# Altium project MyFly.PrjPCB
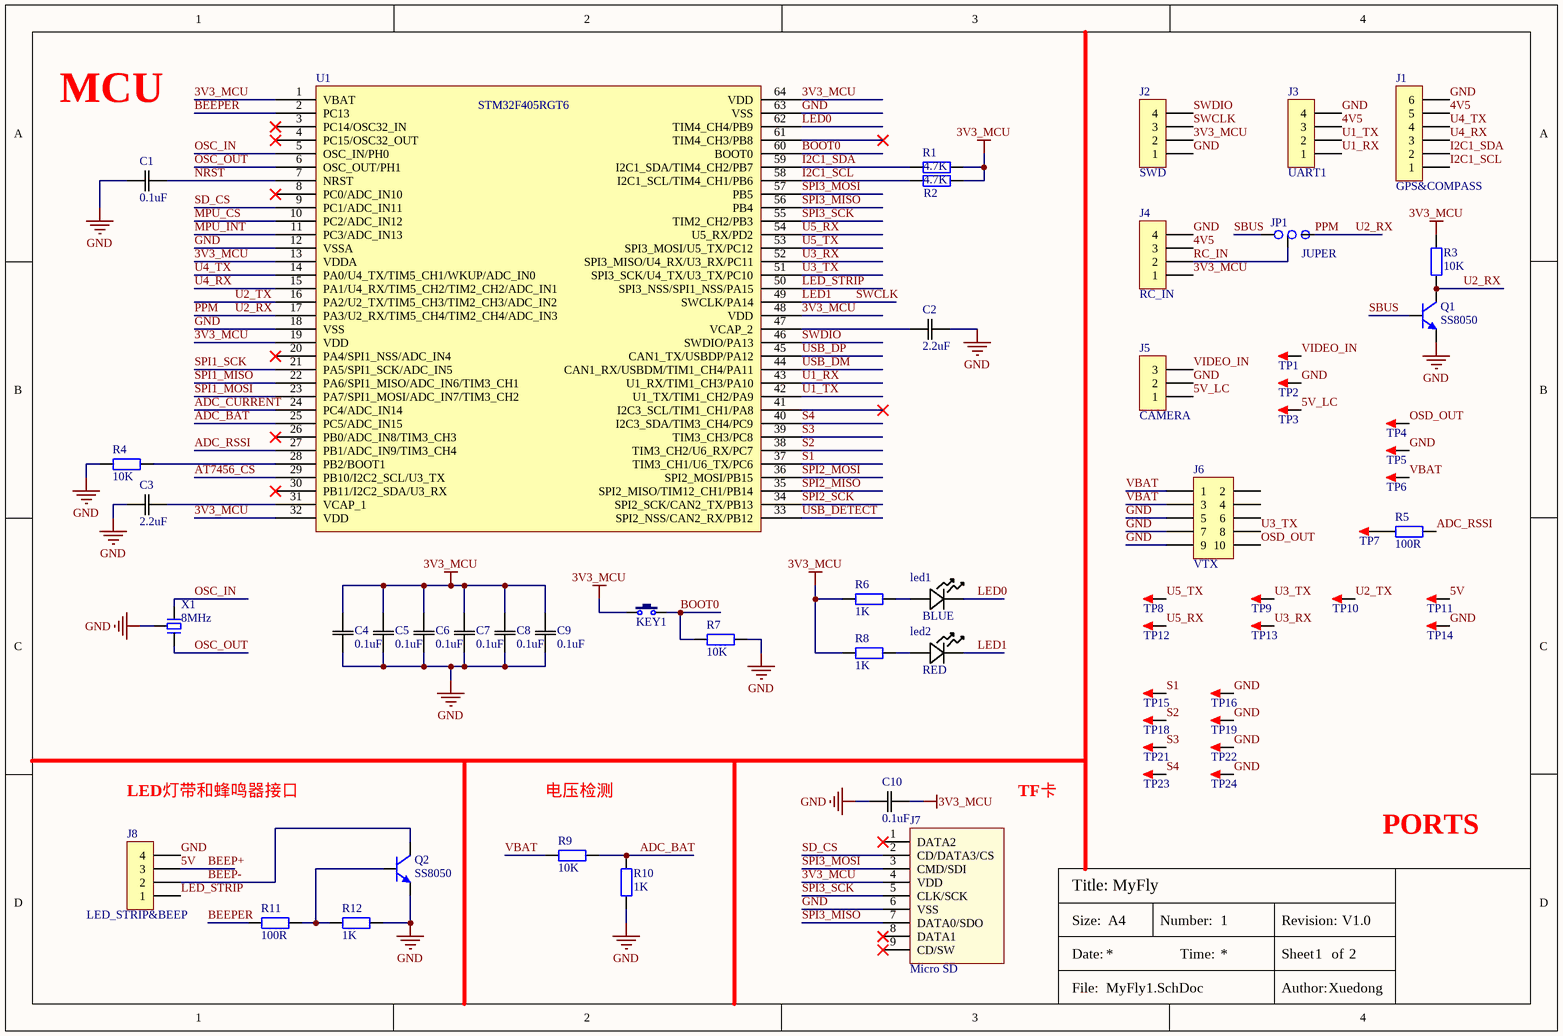
[diagram p0: MyFly1.SchDoc]
2 sheets, 116 parts. Net scope: global (net labels, ports and power ports of the same name join across sheets).
Board file: MyFly.PcbDoc
Sheets:
  MyFly1.SchDoc
  MyFly2.SchDoc

## Sheet MyFly1.SchDoc: MyFly
size A4; Author: Xuedong; DocumentNumber: 1; Revision: V1.0; SheetNumber: 1; SheetTotal: 2

### Parts
C1  0.1uF  [CAP_0402]
C2  2.2uF  [CAP_0402]
C3  2.2uF  [CAP_0402]
C4  0.1uF  [CAP_0402]
C5  0.1uF  [CAP_0402]
C6  0.1uF  [CAP_0402]
C7  0.1uF  [CAP_0402]
C8  0.1uF  [CAP_0402]
C9  0.1uF  [CAP_0402]
C10  0.1uF  [CAP_0603]
J1  GPS&COMPASS  [SH1.0 S-W-6P]
J2  SWD  [SH1.0 S-W-4P]
J3  UART1  [SH1.0 S-W-4P]
J4  RC_IN  [SH1.0 S-W-4P]
J5  CAMERA  [MX 1.25-WS-3P]
J6  VTX  [HDR1.27 2x5-M-SMD]
J7  Micro SD  [MICRO SD]
J8  LED_STRIP&BEEP  [SH1.0 S-W-4P]
JP1  JUPER  [JUMPER 3P]
KEY1  KEY  [KEY_TSW 2*4*3.5-S-W]  (value not drawn)
led1  BLUE  [LED_0603]
led2  RED  [LED_0603]
Q1  SS8050  [SOT23-3L]
Q2  SS8050  [SOT23-3L]
R1  4.7K  [Res_0402]
R2  4.7K  [Res_0402]
R3  10K  [Res_0402]
R4  10K  [Res_0402]
R5  100R  [Res_0402]
R6  1K  [Res_0402]
R7  10K  [Res_0402]
R8  1K  [Res_0402]
R9  10K  [RES_0603]
R10  1K  [RES_0603]
R11  100R  [Res_0402]
R12  1K  [Res_0402]
TP1  TEST  [TEST PAD 1.8]  (value not drawn)
TP2  TEST  [TEST PAD 1.8]  (value not drawn)
TP3  TEST  [TEST PAD 1.8]  (value not drawn)
TP4  TEST  [TEST PAD 1.8]  (value not drawn)
TP5  TEST  [TEST PAD 1.8]  (value not drawn)
TP6  TEST  [TEST PAD 1.8]  (value not drawn)
TP7  TEST  [TEST PAD 1.8]  (value not drawn)
TP8  TEST  [TEST PAD 1.8]  (value not drawn)
TP9  TEST  [TEST PAD 1.8]  (value not drawn)
TP10  TEST  [TEST PAD 1.8]  (value not drawn)
TP11  TEST  [TEST PAD 1.8]  (value not drawn)
TP12  TEST  [TEST PAD 1.8]  (value not drawn)
TP13  TEST  [TEST PAD 1.8]  (value not drawn)
TP14  TEST  [TEST PAD 1.8]  (value not drawn)
TP15  TEST  [TEST PAD 1.8]  (value not drawn)
TP16  TEST  [TEST PAD 1.8]  (value not drawn)
TP18  TEST  [TEST PAD 1.8]  (value not drawn)
TP19  TEST  [TEST PAD 1.8]  (value not drawn)
TP21  TEST  [TEST PAD 1.8]  (value not drawn)
TP22  TEST  [TEST PAD 1.8]  (value not drawn)
TP23  TEST  [TEST PAD 1.8]  (value not drawn)
TP24  TEST  [TEST PAD 1.8]  (value not drawn)
U1  STM32F405RGT6  [LQFP-64]
X1  8MHz  [XTAL-3215-3P]

### Nets
3V3_MCU: C4.2(EPAD) C5.2(EPAD) C6.2(EPAD) C7.2(EPAD) C8.2(EPAD) C9.2(EPAD) C10.2(EPAD) J2.2 J4.1 J7.4(VDD) KEY1.1 R1.2 R2.2 R3.2 R6.1 R8.1 U1.1(VBAT) U1.13(VDDA) U1.19(VDD) U1.32(VDD) U1.48(VDD) U1.64(VDD)
4V5: J1.5 J3.3 J4.3
5V: J8.3 TP11.1  [also labelled BEEP+]
5V_LC: J5.1 TP3.1
GND: C1.1(EPAD) C2.2(EPAD) C3.1(EPAD) C4.1(EPAD) C5.1(EPAD) C6.1(EPAD) C7.1(EPAD) C8.1(EPAD) C9.1(EPAD) C10.1(EPAD) J1.6 J2.1 J3.4 J4.4 J5.2 J6.5 J6.7 J6.9 J7.6(VSS) J8.4 Q1.2(E) Q2.2(E) R4.1 R7.2 R10.1 R12.2 TP2.1 TP5.1 TP14.1 TP16.1 TP19.1 TP22.1 TP24.1 U1.12(VSSA) U1.18(VSS) U1.63(VSS) X1.2
VBAT: J6.1 J6.3 R9.1 TP6.1
ADC_BAT: R9.2 R10.2 U1.25(PC5/ADC_IN15)
ADC_CURRENT: U1.24(PC4/ADC_IN14)
ADC_RSSI: R5.2 U1.27(PB1/ADC_IN9/TIM3_CH4)
AT7456_CS: U1.29(PB10/I2C2_SCL/U3_TX)
BEEP-: J8.2 Q2.3(C)
BEEPER: R11.1 U1.2(PC13)
BOOT0: KEY1.2 R7.1 U1.60(BOOT0)
I2C1_SCL: J1.1 R2.1 U1.58(I2C1_SCL/TIM4_CH1/PB6)
I2C1_SDA: J1.2 R1.1 U1.59(I2C1_SDA/TIM4_CH2/PB7)
LED0: led1.1 U1.62(TIM4_CH4/PB9)
LED1: J2.3 led2.1 U1.49(SWCLK/PA14)  [also labelled SWCLK]
LED_STRIP: J8.1 U1.50(SPI3_NSS/SPI1_NSS/PA15)
MPU_CS: U1.10(PC2/ADC_IN12)
MPU_INT: U1.11(PC3/ADC_IN13)
NRST: C1.2(EPAD) U1.7(NRST)
OSC_IN: U1.5(OSC_IN/PH0) X1.1
OSC_OUT: U1.6(OSC_OUT/PH1) X1.3
OSD_OUT: J6.10 TP4.1
PPM: JP1.3 Q1.3(C) R3.1 U1.17(PA3/U2_RX/TIM5_CH4/TIM2_CH4/ADC_IN3)  [also labelled U2_RX]
RC_IN: J4.2 JP1.2
S1: TP15.1 U1.37(TIM3_CH1/U6_TX/PC6)
S2: TP18.1 U1.38(TIM3_CH2/U6_RX/PC7)
S3: TP21.1 U1.39(TIM3_CH3/PC8)
S4: TP23.1 U1.40(I2C3_SDA/TIM3_CH4/PC9)
SBUS: JP1.1 Q1.1(B)
SD_CS: J7.2(CD/DATA3/CS) U1.9(PC1/ADC_IN11)
SPI1_MISO: U1.22(PA6/SPI1_MISO/ADC_IN6/TIM3_CH1)
SPI1_MOSI: U1.23(PA7/SPI1_MOSI/ADC_IN7/TIM3_CH2)
SPI1_SCK: U1.21(PA5/SPI1_SCK/ADC_IN5)
SPI2_MISO: U1.35(SPI2_MISO/TIM12_CH1/PB14)
SPI2_MOSI: U1.36(SPI2_MOSI/PB15)
SPI2_SCK: U1.34(SPI2_SCK/CAN2_TX/PB13)
SPI3_MISO: J7.7(DATA0/SDO) U1.56(PB4)
SPI3_MOSI: J7.3(CMD/SDI) U1.57(PB5)
SPI3_SCK: J7.5(CLK/SCK) U1.55(TIM2_CH2/PB3)
SWDIO: J2.4 U1.46(SWDIO/PA13)
U1_RX: J3.1 U1.43(U1_RX/TIM1_CH3/PA10)
U1_TX: J3.2 U1.42(U1_TX/TIM1_CH2/PA9)
U2_TX: TP10.1 U1.16(PA2/U2_TX/TIM5_CH3/TIM2_CH3/ADC_IN2)
U3_RX: TP13.1 U1.52(SPI3_MISO/U4_RX/U3_RX/PC11)
U3_TX: J6.8 TP9.1 U1.51(SPI3_SCK/U4_TX/U3_TX/PC10)
U4_RX: J1.3 U1.15(PA1/U4_RX/TIM5_CH2/TIM2_CH2/ADC_IN1)
U4_TX: J1.4 U1.14(PA0/U4_TX/TIM5_CH1/WKUP/ADC_IN0)
U5_RX: TP12.1 U1.54(U5_RX/PD2)
U5_TX: TP8.1 U1.53(SPI3_MOSI/U5_TX/PC12)
USB_DETECT: U1.33(SPI2_NSS/CAN2_RX/PB12)
USB_DM: U1.44(CAN1_RX/USBDM/TIM1_CH4/PA11)
USB_DP: U1.45(CAN1_TX/USBDP/PA12)
VIDEO_IN: J5.3 TP1.1
NetC2_1: C2.1(EPAD) U1.47(VCAP_2)
NetC3_2: C3.2(EPAD) U1.31(VCAP_1)
Netled1_2: led1.2 R6.2
Netled2_2: led2.2 R8.2
NetQ2_1: Q2.1(B) R11.2 R12.1
NetR4_2: R4.2 U1.28(PB2/BOOT1)
NetR5_1: R5.1 TP7.1

Not connected (* = marked no-connect by the designer): J6 2 4 6; J7 1(DATA2)* 8(DATA1)* 9(CD/SW)*; U1 3(PC14/OSC32_IN)* 4(PC15/OSC32_OUT)* 8(PC0/ADC_IN10)* 20(PA4/SPI1_NSS/ADC_IN4)* 26(PB0/ADC_IN8/TIM3_CH3)* 30(PB11/I2C2_SDA/U3_RX)* 41(I2C3_SCL/TIM1_CH1/PA8)* 61(TIM4_CH3/PB8)*

### Notes on the sheet
- MCU
- LED灯带和蜂鸣器接口
- 电压检测
- TF卡
- PORTS
- Title:
- Size:  A4
- Number:
- Revision:
- Date:
- Time:
- Sheet     of
- File:
- Author:

### Library data of the parts
C1-C10 = CAP: 无极性贴片电容; Manufacturer_Part_Number: 04023A0R3BAT2A; Vendor: AVX Corporation; Built_By: EMA_UL_Team; Type: DEV; C: Copyright (C) 2016 Accelerated Designs. All rights reserved; Copyright: Copyright (C) 2016 Accelerated Designs. All rights reserved; RefDes: RefDes; Value: Value
J1 = Header_1x6: 6P接插件; Manufacturer_Part_Number: 826629-6; Vendor: TE Connectivity; Built_By: EMA_UL_Team; C: Copyright (C) 2015 Accelerated Designs. All rights reserved; RefDes: RefDes; Type: DEV; Value: Value
J2-J4 J8 = Header_1x4: 4P接插件; Manufacturer_Part_Number: 826629-4; Vendor: TE Connectivity; Built_By: EMA_UL_Team; C: Copyright (C) 2015 Accelerated Designs. All rights reserved; RefDes: RefDes; Type: DEV; Value: Value
J5 = Header_1x3: 3P接插件; Manufacturer_Part_Number: 826629-3; Vendor: TE Connectivity; Built_By: EMA_UL_Team; C: Copyright (C) 2015 Accelerated Designs. All rights reserved; RefDes: RefDes; Type: DEV; Value: Value
J6 = Header_2x5: 2x5P-接插件; Manufacturer_Part_Number: 826656-5; Vendor: TE Connectivity; Built_By: EMA_UL_Team; C: Copyright (C) 2015 Accelerated Designs. All rights reserved; RefDes: RefDes; Type: DEV; Value: Value
J7 = Micro SD: Micro SD卡; 版权归属: 源创客; BOM名称: Micro SD卡; 学习资源: www.ooocke.com
JP1 = JUMPER 3P: 三点焊盘跳线
KEY1 = KEY: 按键; BOM名称: 3x6轻触开关; 版权归属: 源创客; 学习资源: www.ooocke.com
led1 led2 = LED: 贴片发光二极管; Manufacturer_Part_Number: VLMB1310-GS08; Vendor: Vishay; Built_By: EMA_UL_Team; Type: DEV; C: Copyright (C) 2015 Accelerated Designs. All rights reserved; RefDes: RefDes; Value: Value
Q1 Q2 = S8050-SMD: 高频放大-NPN型; 版权归属: 源创客; 属性: 40V 1.5A 1W 100MHZ; BOM名称: 高频放大-NPN型; 学习资源: www.ooocke.com
R1-R12 = RES: 贴片电阻; Manufacturer_Part_Number: RC0402FR-070RL; Vendor: Yageo; Built_By: EMA_UL_Team; C: Copyright (C) 2015 Accelerated Designs. All rights reserved; RefDes: RefDes; Type: DEV; Value: Value
TP1-TP16 TP18 TP19 TP21-TP24 = TEST: 测试点; 版权归属: 源创客; BOM名称: 测试点; 学习资源: www.ooocke.com
U1 = STM32F405RGT6: Flaah:256/RAM:48/IO:51
X1 = XTAL-3P: 3脚无源晶振; BOM名称: 2脚晶振; 版权归属: 源创客; 学习资源: www.ooocke.com

## Sheet MyFly2.SchDoc: MyFly
size A4; Author: Xuedong; Organization: Altium Limited; DocumentNumber: 2; Revision: V1.0; SheetNumber: 2; SheetTotal: 2
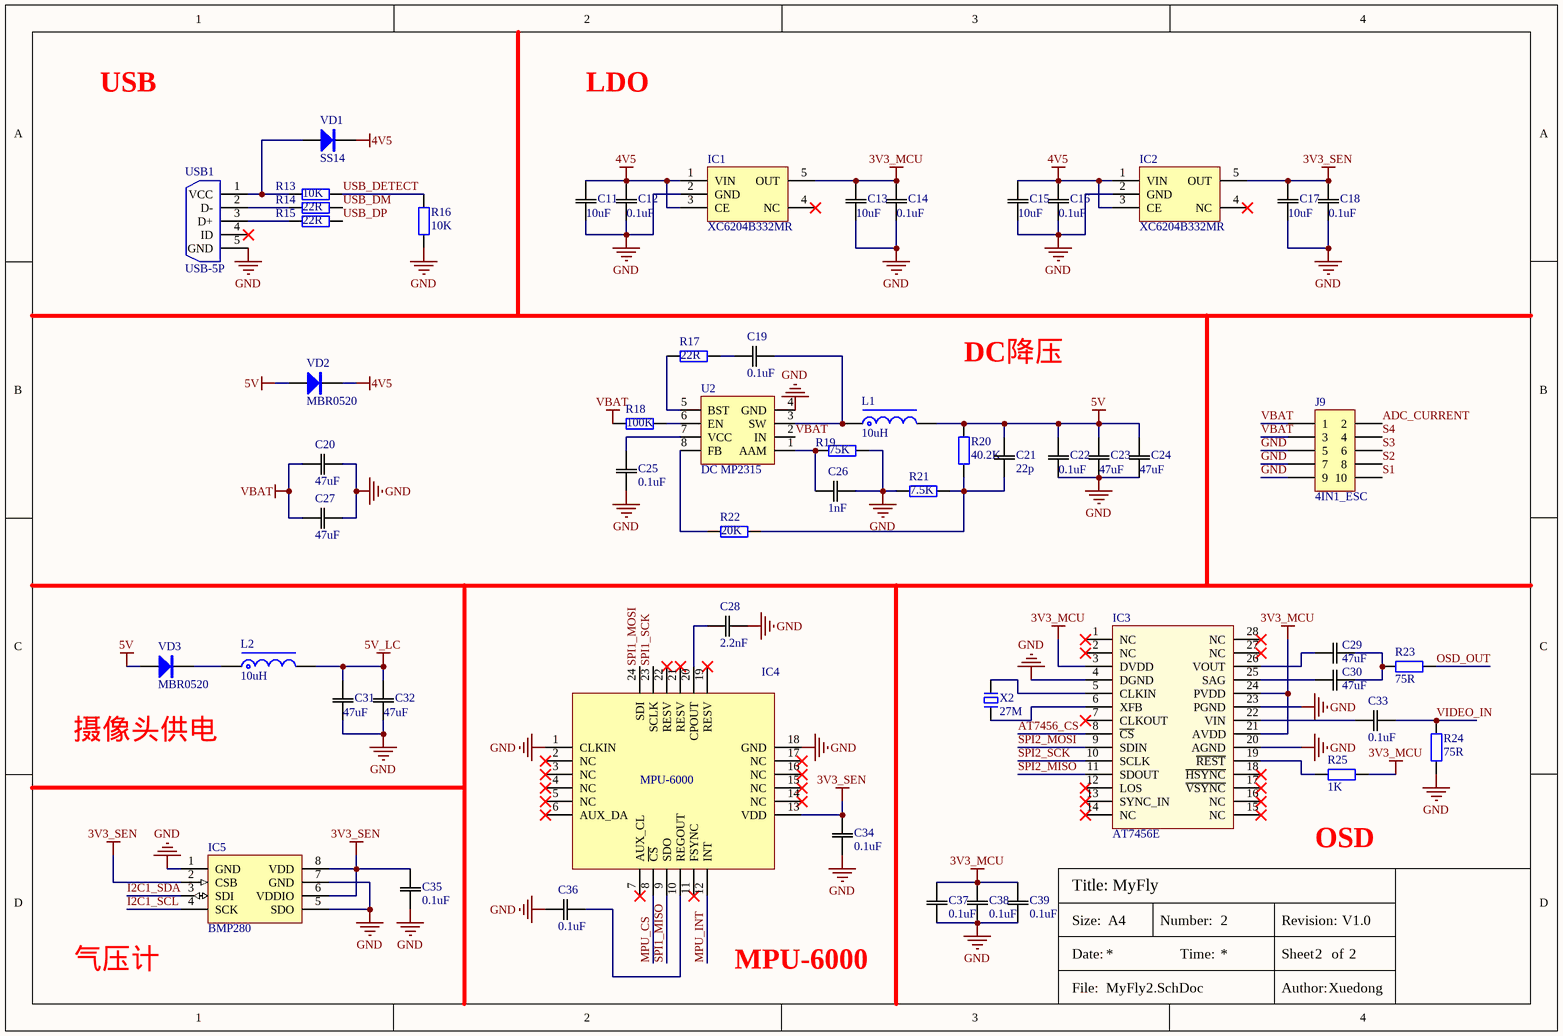
[diagram p1: MyFly2.SchDoc]

### Parts
C11  10uF  [CAP_0603]
C12  0.1uF  [CAP_0603]
C13  10uF  [CAP_0603]
C14  0.1uF  [CAP_0603]
C15  10uF  [CAP_0603]
C16  0.1uF  [CAP_0603]
C17  10uF  [CAP_0603]
C18  0.1uF  [CAP_0603]
C19  0.1uF  [CAP_0603]
C20  47uF  [CAP_1206]
C21  22p  [CAP_0603]
C22  0.1uF  [CAP_0603]
C23  47uF  [CAP_1206]
C24  47uF  [CAP_1206]
C25  0.1uF  [CAP_0603]
C26  1nF  [CAP_0603]
C27  47uF  [CAP_1206]
C28  2.2nF  [CAP_0402]
C29  47uF  [CAP_0805]
C30  47uF  [CAP_0805]
C31  47uF  [CAP_0805]
C32  47uF  [CAP_0805]
C33  0.1uF  [CAP_0402]
C34  0.1uF  [CAP_0402]
C35  0.1uF  [CAP_0603]
C36  0.1uF  [CAP_0402]
C37  0.1uF  [CAP_0402]
C38  0.1uF  [CAP_0402]
C39  0.1uF  [CAP_0402]
IC1  XC6204B332MR  [SOT23-5L]
IC2  XC6204B332MR  [SOT23-5L]
IC3  AT7456E  [TSSOP28_L_E]
IC4  MPU-6000  [QFN24 4X4_N]
IC5  BMP280  [BMP280 LGA8]
J9  4IN1_ESC  [HDR1.27 2x5-SMD]
L1  10uH  [L-SMD-0420]
L2  10uH  [NR3015]
R13  10K  [Res_0402]
R14  22R  [Res_0402]
R15  22R  [Res_0402]
R16  10K  [Res_0402]
R17  22R  [RES_0603]
R18  100K  [RES_0603]
R19  75K  [RES_0603]
R20  40.2K  [RES_0603]
R21  7.5K  [RES_0603]
R22  20K  [RES_0603]
R23  75R  [Res_0402]
R24  75R  [Res_0402]
R25  1K  [Res_0402]
U2  DC MP2315  [SOT23-8L]
USB1  USB-5P  [USB-MICRO_E]
VD1  SS14  [SOD-123]
VD2  MBR0520  [SOD-123]
VD3  MBR0520  [SOD-123]
X2  27M  [XTAL-3225]

### Nets
3V3_MCU: C13.2(EPAD) C14.2(EPAD) C37.2(EPAD) C38.2(EPAD) C39.2(EPAD) IC1.5(OUT) IC3.3(DVDD) IC3.21(AVDD) IC3.24(PVDD) R25.2
3V3_SEN: C17.2(EPAD) C18.2(EPAD) C34.2(EPAD) C35.2(EPAD) IC2.5(OUT) IC4.13(VDD) IC5.2(CSB) IC5.6(VDDIO) IC5.8(VDD)
4V5: C11.2(EPAD) C12.2(EPAD) C15.2(EPAD) C16.2(EPAD) IC1.1(VIN) IC1.3(CE) IC2.1(VIN) IC2.3(CE) VD1.2(K) VD2.2(K)
5V: C21.2(EPAD) C22.2(EPAD) C23.2(EPAD) C24.2(EPAD) L1.2 R20.2 VD2.1(A) VD3.1(A)
5V_LC: C31.2(EPAD) C32.2(EPAD) L2.2
GND: C11.1(EPAD) C12.1(EPAD) C13.1(EPAD) C14.1(EPAD) C15.1(EPAD) C16.1(EPAD) C17.1(EPAD) C18.1(EPAD) C20.1(EPAD) C22.1(EPAD) C23.1(EPAD) C24.1(EPAD) C25.1(EPAD) C26.2(EPAD) C27.1(EPAD) C28.2(EPAD) C31.1(EPAD) C32.1(EPAD) C34.1(EPAD) C35.1(EPAD) C36.1(EPAD) C37.1(EPAD) C38.1(EPAD) C39.1(EPAD) IC1.2(GND) IC2.2(GND) IC3.4(DGND) IC3.20(AGND) IC3.23(PGND) IC4.1(CLKIN) IC4.18(GND) IC5.1(GND) IC5.5(SDO) IC5.7(GND) J9.5 J9.7 J9.9 R16.1 R19.2 R21.1 R24.1 U2.4(GND) USB1.5(GND)
VBAT: C20.2(EPAD) C27.2(EPAD) J9.1 J9.3 R18.1 U2.2(IN)
ADC_CURRENT: J9.2
AT7456_CS: IC3.8(~{CS})
I2C1_SCL: IC5.4(SCK)
I2C1_SDA: IC5.3(SDI)
MPU_CS: IC4.8(~{CS})
MPU_INT: IC4.12(INT)
OSD_OUT: R23.2
S1: J9.10
S2: J9.8
S3: J9.6
S4: J9.4
SPI1_MISO: IC4.9(SDO)
SPI1_MOSI: IC4.24(SDI)
SPI1_SCK: IC4.23(SCLK)
SPI2_MISO: IC3.11(SDOUT)
SPI2_MOSI: IC3.9(SDIN)
SPI2_SCK: IC3.10(SCLK)
USB_DETECT: R13.2 R16.2
USB_DM: R14.2
USB_DP: R15.2
VIDEO_IN: C33.2(EPAD) R24.2
NetC19_1: C19.1(EPAD) R17.2
NetC19_2: C19.2(EPAD) L1.1 U2.3(SW)
NetC21_1: C21.1(EPAD) R20.1 R21.2 R22.2
NetC25_2: C25.2(EPAD) U2.7(VCC)
NetC26_1: C26.1(EPAD) R19.1 U2.1(AAM)
NetC28_1: C28.1(EPAD) IC4.20(CPOUT)
NetC29_1: C29.1(EPAD) IC3.26(VOUT)
NetC29_2: C29.2(EPAD) C30.2(EPAD) R23.1
NetC30_1: C30.1(EPAD) IC3.25(SAG)
NetC33_1: C33.1(EPAD) IC3.22(VIN)
NetC36_2: C36.2(EPAD) IC4.10(REGOUT)
NetIC3_5: IC3.5(CLKIN) X2.3
NetIC3_6: IC3.6(XFB) X2.1
NetIC3_19: IC3.19(~{REST}) R25.1
NetL2_1: L2.1 VD3.2(K)
NetR13_1: R13.1 USB1.1(VCC) VD1.1(A)
NetR14_1: R14.1 USB1.2(D-)
NetR15_1: R15.1 USB1.3(D+)
NetR17_1: R17.1 U2.5(BST)
NetR18_2: R18.2 U2.6(EN)
NetR22_1: R22.1 U2.8(FB)

Not connected (* = marked no-connect by the designer): IC1 4(NC)*; IC2 4(NC)*; IC3 1(NC)* 2(NC)* 7(CLKOUT)* 12(LOS)* 13(SYNC_IN)* 14(NC)* 15(NC)* 16(NC)* 17(~{VSYNC})* 18(~{HSYNC})* 27(NC)* 28(NC)*; IC4 2(NC)* 3(NC)* 4(NC)* 5(NC)* 6(AUX_DA)* 7(AUX_CL)* 11(FSYNC)* 14(NC)* 15(NC)* 16(NC)* 17(NC)* 19(RESV)* 21(RESV)* 22(RESV)*; USB1 4(ID)*

### Notes on the sheet
- USB
- LDO
- DC降压
- (near VD3) 摄像头供电
- (near R25) OSD
- 气压计
- MPU-6000
- Title:
- Size:  A4
- Number:
- Revision:
- Date:
- Time:
- Sheet     of
- File:
- Author:

### Library data of the parts
C11-C39 = CAP: as C1 on sheet MyFly1; Copyright: Copyright (C) 2016 Accelerated Designs. All rights reserved; RefDes: RefDes; Value: Value
IC1 IC2 = LDO XC6204: LDO; BOM名称: 稳压芯片; 版权归属: 源创客; 学习资源: www.ooocke.com
IC3 = AT7456E: OSD芯片
IC4 = MPU-6000: 传感器; ComponentLink1Description: 供应商链接; ComponentLink1URL: http://www.szlcsc.com/product/details_24852.html; Package: QFN-24_4x4x05P; Supplier: LC; SuppliersPartNumber: C24112
IC5 = BMP280: 气压传感器
J9 = Header_2x5: as J6 on sheet MyFly1; RefDes: RefDes; Type: DEV; Value: Value
L1 = L-CDRH: 功率屏蔽电感; 版权归属: 源创客; BOM名称: 功率屏蔽电感; 学习资源: www.ooocke.com
L2 = L-NR: NR功率电感; 版权归属: 源创客; BOM名称: NR功率电感; 学习资源: www.ooocke.com
R13-R25 = RES: as R1 on sheet MyFly1; RefDes: RefDes; Type: DEV; Value: Value
U2 = DC MP2315: DC降压芯片
USB1 = USB-5P: 微型USB母座; 版权归属: 源创客; BOM名称: 微型USB母座; 学习资源: www.ooocke.com
VD1-VD3 = SS14: 肖特基二极管; 版权归属: 源创客; 属性: 40V/1A; BOM名称: 肖特基二极管; 学习资源: www.ooocke.com
X2 = XTAL-4P: 4脚无源晶振; BOM名称: 4脚晶振; 版权归属: 源创客; 学习资源: www.ooocke.com

## Nets that join several sheets
3V3_MCU: MyFly1 (22 pins), MyFly2 (10 pins)
4V5: MyFly1 (J1.5 J3.3 J4.3), MyFly2 (10 pins)
5V: MyFly1 (J8.3 TP11.1), MyFly2 (8 pins)
5V_LC: MyFly1 (J5.1 TP3.1), MyFly2 (C31.2 C32.2 L2.2)
GND: MyFly1 (37 pins), MyFly2 (43 pins)
VBAT: MyFly1 (J6.1 J6.3 R9.1 TP6.1), MyFly2 (6 pins)
ADC_CURRENT: MyFly1 (U1.24), MyFly2 (J9.2)
AT7456_CS: MyFly1 (U1.29), MyFly2 (IC3.8)
I2C1_SCL: MyFly1 (J1.1 R2.1 U1.58), MyFly2 (IC5.4)
I2C1_SDA: MyFly1 (J1.2 R1.1 U1.59), MyFly2 (IC5.3)
MPU_CS: MyFly1 (U1.10), MyFly2 (IC4.8)
MPU_INT: MyFly1 (U1.11), MyFly2 (IC4.12)
OSD_OUT: MyFly1 (J6.10 TP4.1), MyFly2 (R23.2)
S1: MyFly1 (TP15.1 U1.37), MyFly2 (J9.10)
S2: MyFly1 (TP18.1 U1.38), MyFly2 (J9.8)
S3: MyFly1 (TP21.1 U1.39), MyFly2 (J9.6)
S4: MyFly1 (TP23.1 U1.40), MyFly2 (J9.4)
SPI1_MISO: MyFly1 (U1.22), MyFly2 (IC4.9)
SPI1_MOSI: MyFly1 (U1.23), MyFly2 (IC4.24)
SPI1_SCK: MyFly1 (U1.21), MyFly2 (IC4.23)
SPI2_MISO: MyFly1 (U1.35), MyFly2 (IC3.11)
SPI2_MOSI: MyFly1 (U1.36), MyFly2 (IC3.9)
SPI2_SCK: MyFly1 (U1.34), MyFly2 (IC3.10)
USB_DETECT: MyFly1 (U1.33), MyFly2 (R13.2 R16.2)
USB_DM: MyFly1 (U1.44), MyFly2 (R14.2)
USB_DP: MyFly1 (U1.45), MyFly2 (R15.2)
VIDEO_IN: MyFly1 (J5.3 TP1.1), MyFly2 (C33.2 R24.2)